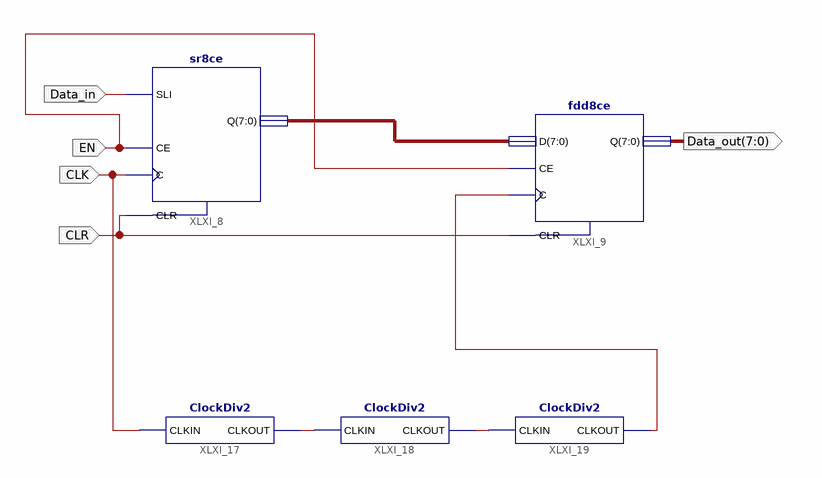
[diagram p0: schematic sheet 1]
// Xilinx ISE schematic UARTReceiver.sch (xbr) as structural Verilog: 5 symbols, 5 ports
module UARTReceiver (
  input  Data_in,
  input  EN,
  input  CLR,
  input  CLK,
  output [7:0] Data_out
);

  wire XLXN_41, XLXN_42, XLXN_43;
  wire [7:0] XLXN_17;

  fdd8ce XLXI_9 (.C(XLXN_41), .CE(EN), .CLR(CLR), .D(XLXN_17), .Q(Data_out));
  sr8ce XLXI_8 (.C(CLK), .CE(EN), .CLR(CLR), .SLI(Data_in), .Q(XLXN_17));
  ClockDiv2 XLXI_17 (.CLKIN(CLK), .CLKOUT(XLXN_42));
  ClockDiv2 XLXI_18 (.CLKIN(XLXN_42), .CLKOUT(XLXN_43));
  ClockDiv2 XLXI_19 (.CLKIN(XLXN_43), .CLKOUT(XLXN_41));
endmodule
